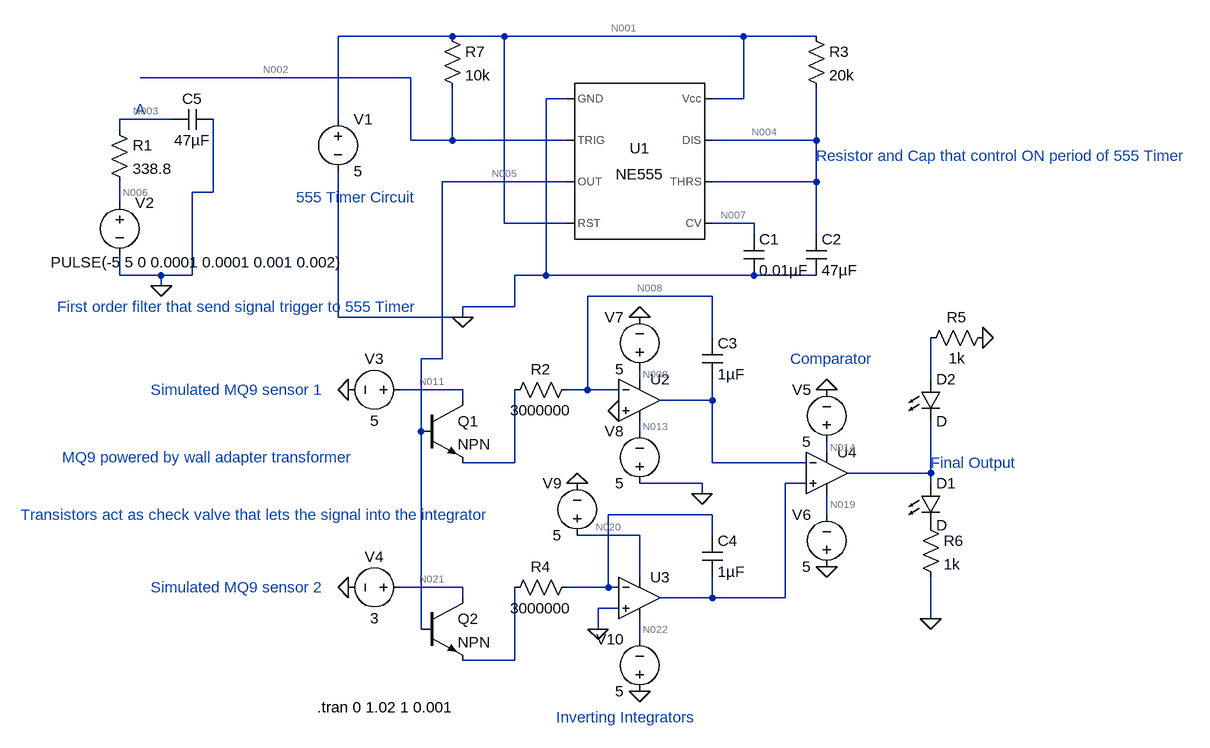
[diagram p0: schematic LTSpiceOmegaLab3.asc]
LTSpiceOmegaLab3.asc, the LTspice schematic file:
Version 4
SHEET 1 1036 968
WIRE -144 -96 -320 -96
WIRE -64 -96 -144 -96
WIRE 304 -96 -64 -96
WIRE 416 -96 304 -96
WIRE -208 -32 -624 -32
WIRE 32 0 0 0
WIRE 304 0 304 -96
WIRE 304 0 256 0
WIRE -576 32 -656 32
WIRE -320 32 -320 -96
WIRE -656 48 -656 32
WIRE -208 64 -208 -32
WIRE -144 64 -144 -16
WIRE -144 64 -208 64
WIRE 32 64 -144 64
WIRE 416 64 416 -16
WIRE 416 64 256 64
WIRE 32 128 -160 128
WIRE 416 128 416 64
WIRE 416 128 256 128
WIRE -512 144 -512 32
WIRE -512 144 -544 144
WIRE -656 160 -656 128
WIRE -64 192 -64 -96
WIRE 32 192 -64 192
WIRE 320 192 256 192
WIRE 320 208 320 192
WIRE 416 208 416 128
WIRE -656 272 -656 240
WIRE -592 272 -656 272
WIRE -544 272 -544 144
WIRE -544 272 -592 272
WIRE 0 272 0 0
WIRE 0 272 -48 272
WIRE 320 272 0 272
WIRE 416 272 320 272
WIRE -592 288 -592 272
WIRE 256 304 64 304
WIRE -48 320 -48 272
WIRE -48 320 -128 320
WIRE -320 336 -320 112
WIRE -128 336 -128 320
WIRE -128 336 -320 336
WIRE 256 368 256 304
WIRE -160 400 -160 128
WIRE -160 400 -192 400
WIRE 144 432 144 416
WIRE 592 432 592 368
WIRE -128 448 -224 448
WIRE 64 448 64 304
WIRE 64 448 32 448
WIRE 112 448 64 448
WIRE -128 464 -128 448
WIRE 256 464 256 432
WIRE 256 464 176 464
WIRE -192 512 -192 400
WIRE 144 512 144 496
WIRE 432 544 432 528
WIRE -48 560 -48 448
WIRE -48 560 -128 560
WIRE 256 560 256 464
WIRE 400 560 256 560
WIRE 592 576 592 496
WIRE 592 576 464 576
WIRE 240 592 144 592
WIRE 400 592 368 592
WIRE 592 592 592 576
WIRE 240 608 240 592
WIRE 256 640 96 640
WIRE 432 640 432 608
WIRE 144 672 48 672
WIRE 256 672 256 640
WIRE 144 736 144 672
WIRE -128 752 -224 752
WIRE 96 752 96 640
WIRE 96 752 32 752
WIRE 112 752 96 752
WIRE -128 768 -128 752
WIRE 256 768 256 736
WIRE 256 768 176 768
WIRE 368 768 368 592
WIRE 368 768 256 768
WIRE 112 784 80 784
WIRE 592 800 592 736
WIRE -192 816 -192 512
WIRE 80 816 80 784
WIRE 144 832 144 800
WIRE -48 864 -48 752
WIRE -48 864 -128 864
FLAG -128 336 0
FLAG 80 816 0
FLAG 144 912 0
FLAG 144 336 0
FLAG -304 752 0
FLAG -304 448 0
FLAG 432 720 0
FLAG 432 448 0
FLAG 592 800 0
FLAG 112 480 0
FLAG 240 608 0
FLAG 672 368 0
FLAG 48 592 0
FLAG -592 288 0
SYMBOL Misc\\NE555 144 96 R0
SYMATTR InstName U1
SYMBOL cap 304 208 R0
SYMATTR InstName C1
SYMATTR Value 0.01µF
SYMBOL cap 400 208 R0
SYMATTR InstName C2
SYMATTR Value 47µF
SYMBOL res 400 -112 R0
SYMATTR InstName R3
SYMATTR Value 20k
SYMBOL voltage -320 16 R0
WINDOW 123 0 0 Left 0
WINDOW 39 0 0 Left 0
SYMATTR InstName V1
SYMATTR Value 5
SYMBOL voltage -208 448 R90
WINDOW 0 -32 56 VBottom 2
WINDOW 3 32 56 VTop 2
WINDOW 123 0 0 Left 0
WINDOW 39 0 0 Left 0
SYMATTR InstName V3
SYMATTR Value 5
SYMBOL res -64 464 R270
WINDOW 0 32 56 VTop 2
WINDOW 3 0 56 VBottom 2
SYMATTR InstName R2
SYMATTR Value 3000000
SYMBOL Opamps\\UniversalOpamp2 144 464 R0
SYMATTR InstName U2
SYMBOL cap 240 368 R0
SYMATTR InstName C3
SYMATTR Value 1µF
SYMBOL voltage -208 752 R90
WINDOW 0 -32 56 VBottom 2
WINDOW 3 32 56 VTop 2
WINDOW 123 0 0 Left 0
WINDOW 39 0 0 Left 0
SYMATTR InstName V4
SYMATTR Value 3
SYMBOL res 48 736 R90
WINDOW 0 0 56 VBottom 2
WINDOW 3 32 56 VTop 2
SYMATTR InstName R4
SYMATTR Value 3000000
SYMBOL Opamps\\UniversalOpamp2 144 768 R0
SYMATTR InstName U3
SYMBOL cap 240 672 R0
SYMATTR InstName C4
SYMATTR Value 1µF
SYMBOL Opamps\\UniversalOpamp2 432 576 R0
SYMATTR InstName U4
SYMBOL LED 576 592 R0
SYMATTR InstName D1
SYMBOL LED 576 432 R0
SYMATTR InstName D2
SYMBOL npn -192 464 R0
SYMATTR InstName Q1
SYMBOL npn -192 768 R0
SYMATTR InstName Q2
SYMBOL voltage 432 544 R180
WINDOW 0 24 96 Left 2
WINDOW 3 24 16 Left 2
WINDOW 123 0 0 Left 0
WINDOW 39 0 0 Left 0
SYMATTR InstName V5
SYMATTR Value 5
SYMBOL voltage 432 736 R180
WINDOW 0 24 96 Left 2
WINDOW 3 24 16 Left 2
WINDOW 123 0 0 Left 0
WINDOW 39 0 0 Left 0
SYMATTR InstName V6
SYMATTR Value 5
SYMBOL voltage 144 432 R180
WINDOW 0 24 96 Left 2
WINDOW 3 24 16 Left 2
WINDOW 123 0 0 Left 0
WINDOW 39 0 0 Left 0
SYMATTR InstName V7
SYMATTR Value 5
SYMBOL voltage 144 608 R180
WINDOW 0 24 96 Left 2
WINDOW 3 24 16 Left 2
WINDOW 123 0 0 Left 0
WINDOW 39 0 0 Left 0
SYMATTR InstName V8
SYMATTR Value 5
SYMBOL voltage 144 928 R180
WINDOW 0 24 96 Left 2
WINDOW 3 24 16 Left 2
WINDOW 123 0 0 Left 0
WINDOW 39 0 0 Left 0
SYMATTR InstName V10
SYMATTR Value 5
SYMBOL res 576 640 R0
SYMATTR InstName R6
SYMATTR Value 1k
SYMBOL res 688 352 R90
WINDOW 0 0 56 VBottom 2
WINDOW 3 32 56 VTop 2
SYMATTR InstName R5
SYMATTR Value 1k
SYMBOL voltage 48 688 R180
WINDOW 0 24 96 Left 2
WINDOW 3 24 16 Left 2
WINDOW 123 0 0 Left 0
WINDOW 39 0 0 Left 0
SYMATTR InstName V9
SYMATTR Value 5
SYMBOL voltage -656 144 R0
WINDOW 123 0 0 Left 0
WINDOW 39 0 0 Left 0
WINDOW 3 -106 108 Left 2
SYMATTR InstName V2
SYMATTR Value PULSE(-5 5 0 0.0001 0.0001 0.001 0.002)
SYMBOL res -672 32 R0
SYMATTR InstName R1
SYMATTR Value 338.8
SYMBOL cap -576 48 R270
WINDOW 0 32 32 VTop 2
WINDOW 3 0 32 VBottom 2
SYMATTR InstName C5
SYMATTR Value 47µF
SYMBOL res -160 -112 R0
SYMATTR InstName R7
SYMATTR Value 10k
TEXT -352 936 Left 2 !.tran 0 1.02 1 0.001
TEXT 592 560 Left 2 ;Final Output
TEXT 416 88 Left 2 ;Resistor and Cap that control ON period of 555 Timer
TEXT -608 448 Left 2 ;Simulated MQ9 sensor 1
TEXT -608 752 Left 2 ;Simulated MQ9 sensor 2
TEXT -808 640 Left 2 ;Transistors act as check valve that lets the signal into the integrator
TEXT -384 152 Left 2 ;555 Timer Circuit
TEXT 376 400 Left 2 ;Comparator
TEXT 16 952 Left 2 ;Inverting Integrators
TEXT -744 552 Left 2 ;MQ9 powered by wall adapter transformer
TEXT -752 320 Left 2 ;First order filter that send signal trigger to 555 Timer
TEXT -632 16 Left 2 ;A

The netlist it stands for:
* LTSpiceOmegaLab3.asc
XU1 0 N002 N005 N001 N007 N004 N004 N001 NE555  ; pins GND TRIG OUT RST CV THRS DIS Vcc
C1 N007 0 0.01µF
C2 N004 0 47µF
R3 N001 N004 20k
V1 N001 0 5
V3 N011 0 5
R2 N015 N008 3000000
XU2 0 N008 N009 N013 N012 level.2 Avol=1Meg GBW=10Meg Slew=10Meg ilimit=25m rail=0 Vos=0 phimargin=45 en=0 enk=0 in=0 ink=0 Rin=500Meg  ; pins IN+ IN- V+ V- OUT
C3 N008 N012 1µF
V4 N021 0 3
R4 N018 N023 3000000
XU3 0 N018 N020 N022 N017 level.2 Avol=1Meg GBW=10Meg Slew=10Meg ilimit=25m rail=0 Vos=0 phimargin=45 en=0 enk=0 in=0 ink=0 Rin=500Meg  ; pins IN+ IN- V+ V- OUT
C4 N018 N017 1µF
XU4 N017 N012 N014 N019 N016 level.2 Avol=1Meg GBW=10Meg Slew=10Meg ilimit=25m rail=0 Vos=0 phimargin=45 en=0 enk=0 in=0 ink=0 Rin=500Meg  ; pins IN+ IN- V+ V- OUT
D1 N016 P001 D
D2 N010 N016 D
Q1 N011 N005 N015 0 NPN
Q2 N021 N005 N023 0 NPN
V5 N014 0 5
V6 0 N019 5
V7 N009 0 5
V8 0 N013 5
V10 0 N022 5
R6 P001 0 1k
R5 0 N010 1k
V9 N020 0 5
V2 N006 0 PULSE(-5 5 0 0.0001 0.0001 0.001 0.002)
R1 N003 N006 338.8
C5 N003 0 47µF
R7 N001 N002 10k
.model D D
.lib standard.dio
.model NPN NPN
.model PNP PNP
.lib standard.bjt
.tran 0 1.02 1 0.001
* Final Output
* Resistor and Cap that control ON period of 555 Timer
* Simulated MQ9 sensor 1
* Simulated MQ9 sensor 2
* Transistors act as check valve that lets the signal into the integrator
* 555 Timer Circuit
* Comparator
* Inverting Integrators
* MQ9 powered by wall adapter transformer
* First order filter that send signal trigger to 555 Timer
* A
.lib NE555.sub
.lib UniversalOpamps2.sub
.backanno
.end

* Results of the author's LTspice run, read from the files saved beside the schematic
* Operating Point, zero values left out:
*   V(n002) = 5 V
*   V(n007) = 3.333 V
*   V(n001) = 5 V
*   V(n004) = 1.5 mV
*   V(n005) = 30 µV
*   V(n011) = 5 V
*   V(n009) = 5 V
*   V(n013) = -5 V
*   V(n021) = 3 V
*   V(n020) = 5 V
*   V(n022) = -5 V
*   V(n014) = 5 V
*   V(n019) = -5 V
*   V(n006) = -5 V
*   V(n003) = -5 V
*   Ic(Q2) = 3 pA
*   Ib(Q2) = -3 pA
*   Ic(Q1) = 5 pA
*   Ib(Q1) = -5 pA
*   I(C5) = 80.81 nA
*   I(R7) = 5 nA
*   I(R1) = -80.81 nA
*   I(R3) = 249.9 µA
*   I(V2) = -80.81 nA
*   I(V9) = -500 µA
*   I(V10) = -500 µA
*   I(V8) = -500 µA
*   I(V7) = -500 µA
*   I(V6) = -500 µA
*   I(V5) = -500 µA
*   I(V4) = -3 pA
*   I(V3) = -5 pA
*   I(V1) = -1.861 mA
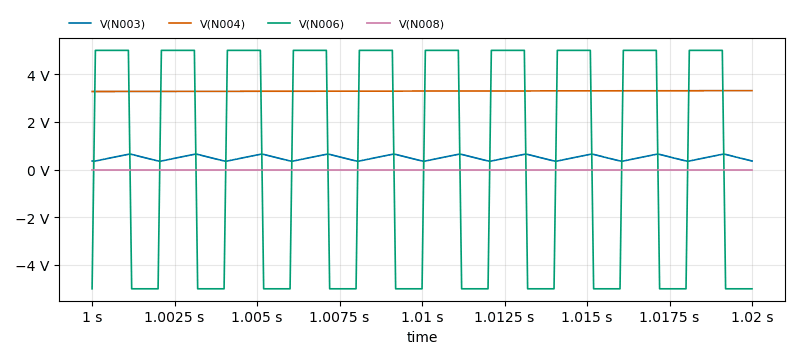
[diagram p1: Transient Analysis of LTSpiceOmegaLab3.asc, plotted from the saved traces]
* Transient Analysis, 1 run:
*   V(N003): min 352.9 mV, max 646.6 mV, average 499.6 mV, rms 510.3 mV, last 360.6 mV
*   V(N004): min 3.275 V, max 3.311 V, average 3.293 V, rms 3.293 V, last 3.311 V
*   V(N006): min -5 V, max 5 V, average 500 mV, rms 4.854 V, last -5 V
*   V(N008): min 1.126 µV, max 1.149 µV, average 1.138 µV, rms 1.138 µV, last 1.149 µV